# Altium schematic sheet MCU.SchDoc
size A3; SheetNumber: 7; SheetTotal: 10
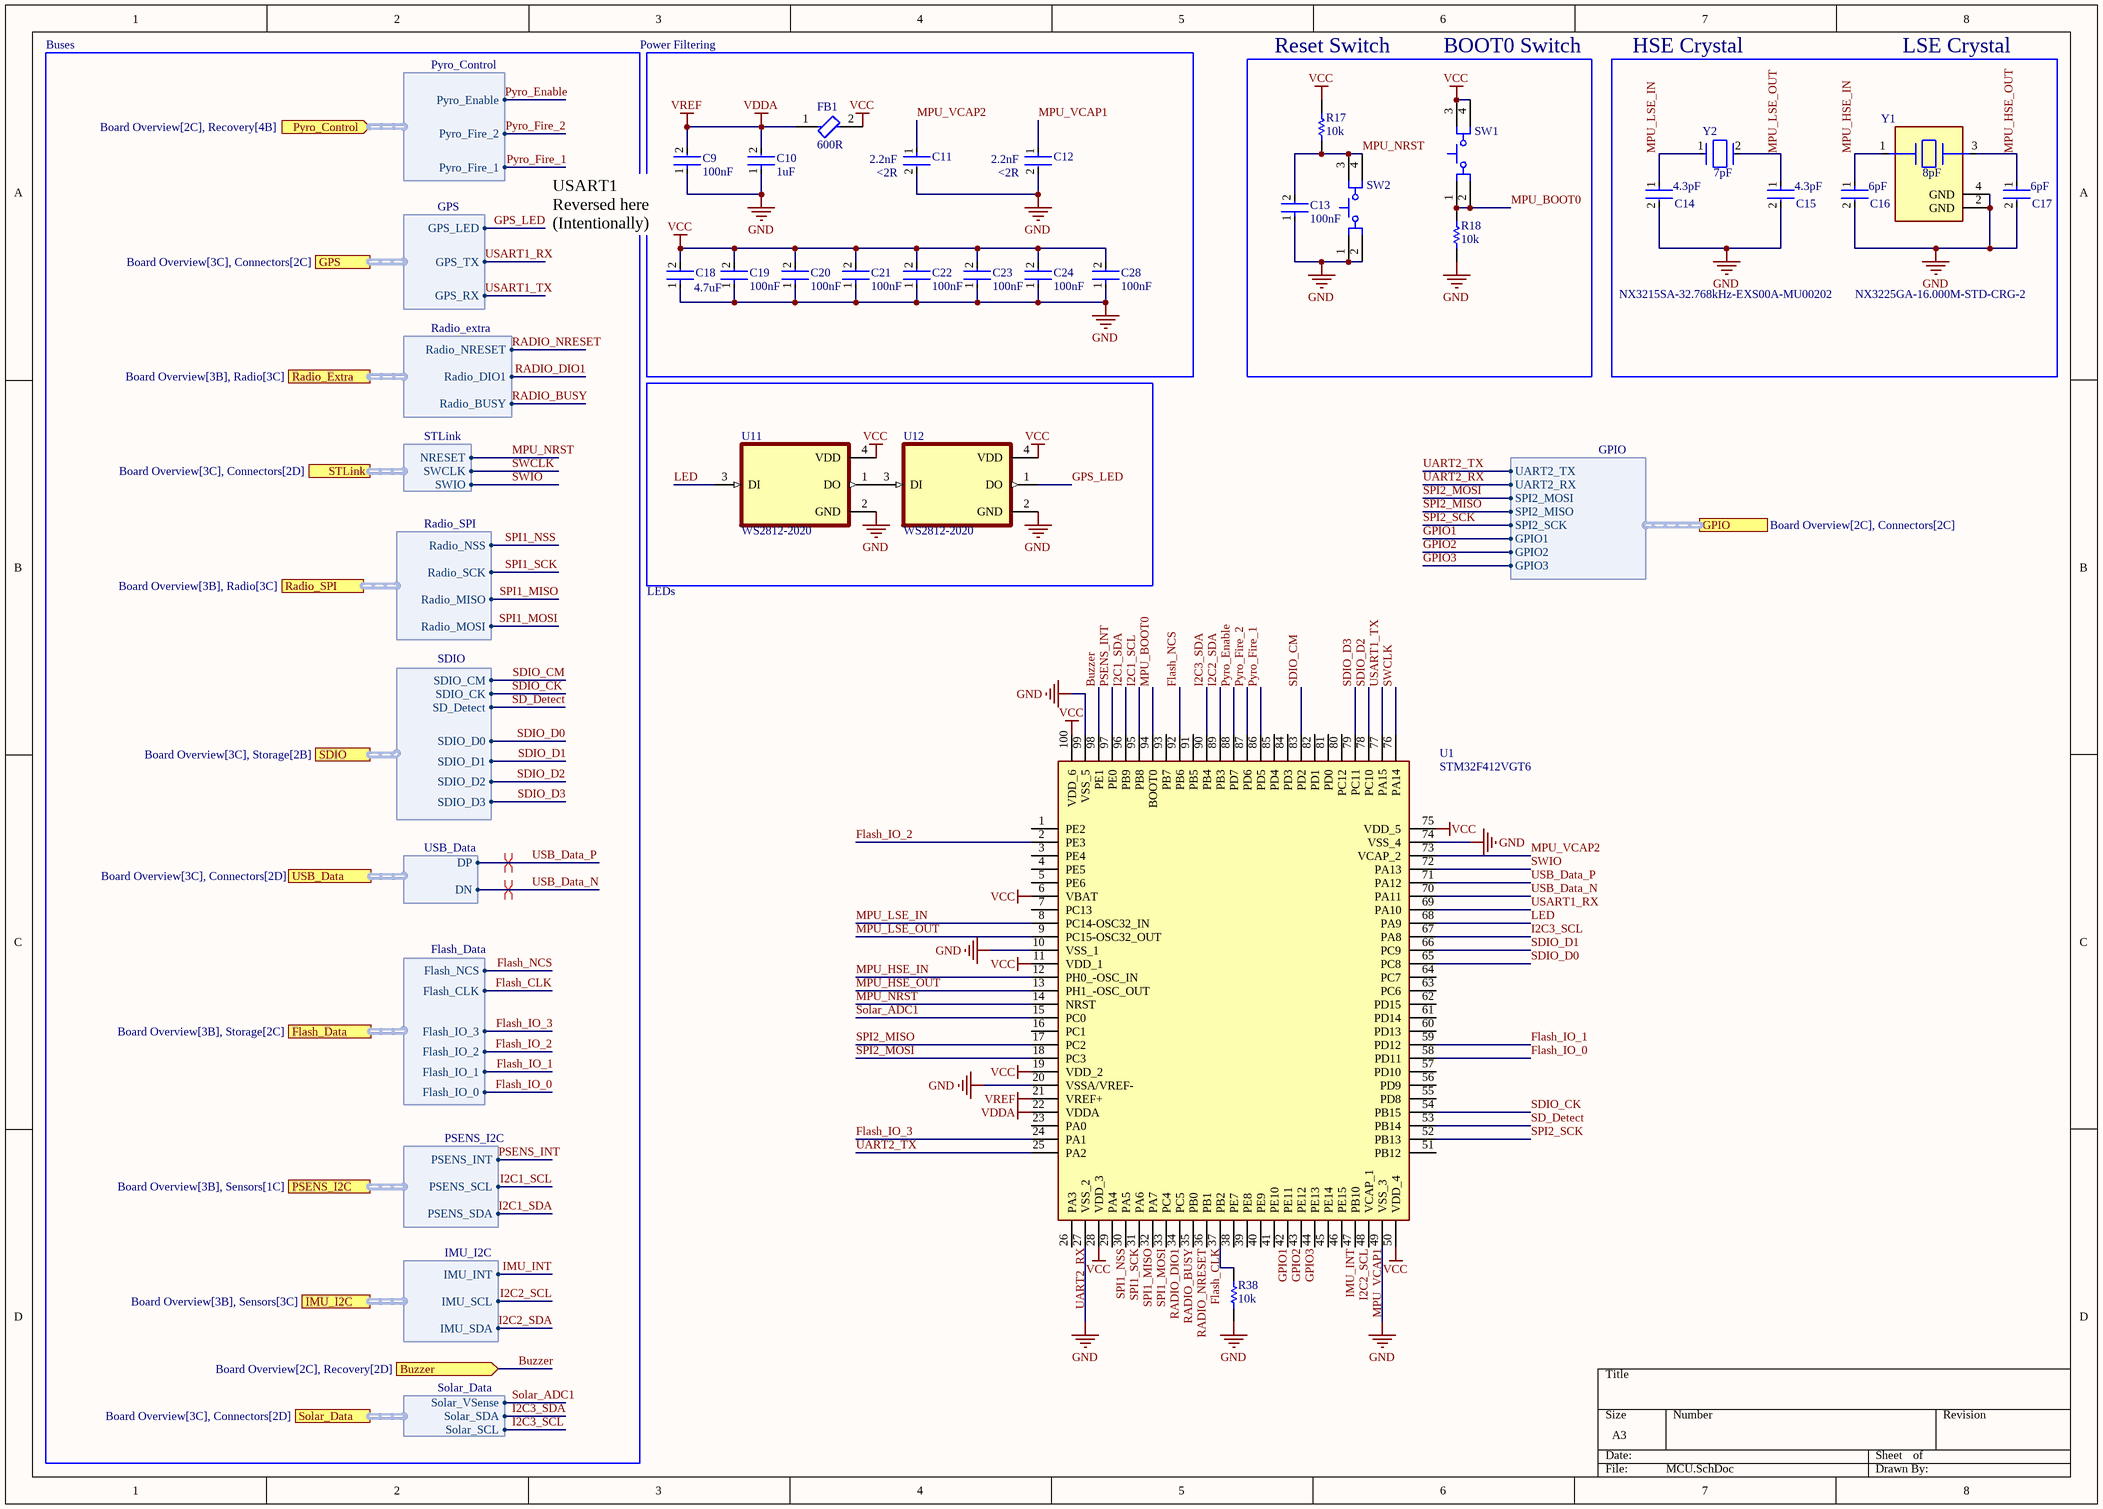
[diagram p0: MCU.SchDoc]

## Parts
C9  value 100nF  [FP-0603-L_1_6_0_15-W_0_81-IPC_C]  (hidden comment: Generic-Capacitor)
C10  value 1uF  [FP-0603-L_1_6_0_15-W_0_81-IPC_C]  (hidden comment: Generic-Capacitor)
C11  value 2.2nF  ESR: <2R  [FP-0603-L_1_6_0_15-W_0_81-IPC_C]  (hidden comment: Generic-Capacitor)
C12  value 2.2nF  ESR: <2R  [FP-0603-L_1_6_0_15-W_0_81-IPC_C]  (hidden comment: Generic-Capacitor)
C13  value 100nF  [FP-0603-L_1_6_0_15-W_0_81-IPC_C]  (hidden comment: Generic-Capacitor)
C14  value 4.3pF  [FP-CL10-IPC_B]  (hidden comment: 0603CG4R3C500NT)
C15  value 4.3pF  [FP-CL10-IPC_B]  (hidden comment: 0603CG4R3C500NT)
C16  value 6pF  [FP-CL10-IPC_B]  (hidden comment: CL10C060DB8NNNC)
C17  value 6pF  [FP-CL10-IPC_B]  (hidden comment: CL10C060DB8NNNC)
C18  value 4.7uF  [FP-0603-L_1_6_0_15-W_0_81-IPC_C]  (hidden comment: Generic-Capacitor)
C19  value 100nF  [FP-0603-L_1_6_0_15-W_0_81-IPC_C]  (hidden comment: Generic-Capacitor)
C20  value 100nF  [FP-0603-L_1_6_0_15-W_0_81-IPC_C]  (hidden comment: Generic-Capacitor)
C21  value 100nF  [FP-0603-L_1_6_0_15-W_0_81-IPC_C]  (hidden comment: Generic-Capacitor)
C22  value 100nF  [FP-0603-L_1_6_0_15-W_0_81-IPC_C]  (hidden comment: Generic-Capacitor)
C23  value 100nF  [FP-0603-L_1_6_0_15-W_0_81-IPC_C]  (hidden comment: Generic-Capacitor)
C24  value 100nF  [FP-0603-L_1_6_0_15-W_0_81-IPC_C]  (hidden comment: Generic-Capacitor)
C28  value 100nF  [FP-0603-L_1_6_0_15-W_0_81-IPC_C]  (hidden comment: Generic-Capacitor)
FB1  value 600R  [FP-BLM18-0_15-0_1-t0_6-IPC_B]  (hidden comment: GZ1608D601TF)
R17  value 10k  [RESC1608X55X25ML10T15]  (hidden comment: 0603WAF1002T5E)
R18  value 10k  [RESC1608X55X25ML10T15]  (hidden comment: 0603WAF1002T5E)
R38  value 10k  [RESC1609X50X30ML8T20]  (hidden comment: Generic-Resistor)
SW1  PTS645SM43SMTR92LFS  [CKCP-PTS645S_V]  (value not drawn)
SW2  PTS645SM43SMTR92LFS  [CKCP-PTS645S_V]  (value not drawn)
U1  STM32F412VGT6  [QFP50P1600X1600X160-100N]
U11  WS2812-2020  [LED_WS2812-2020]
U12  WS2812-2020  [LED_WS2812-2020]
Y1  NX3225GA-16.000M-STD-CRG-2  value 8pF  [FP-NX3225GA-MFG]
Y2  NX3215SA-32.768kHz-EXS00A-MU00202  value 7pF  [FP-NX3215SA-MFG]

## Ports
Buzzer (in, see Board Overview[2C], Recovery[2D]), Flash_Data (harness Flash_Data, see Board Overview[3B], Storage[2C]), GPIO (harness GPIO, see Board Overview[2C], Connectors[2C]), GPS (harness GPS, see Board Overview[3C], Connectors[2C]), IMU_I2C (harness IMU_I2C, see Board Overview[3B], Sensors[3C]), PSENS_I2C (harness PSENS_I2C, see Board Overview[3B], Sensors[1C]), Pyro_Control (in, harness Pyro_Control, see Board Overview[2C], Recovery[4B]), Radio_Extra (harness Radio_extra, see Board Overview[3B], Radio[3C]), Radio_SPI (harness Radio_SPI, see Board Overview[3B], Radio[3C]), SDIO (harness SDIO, see Board Overview[3C], Storage[2B]), Solar_Data (harness Solar_Data, see Board Overview[3C], Connectors[2D]), STLink (harness STLink, see Board Overview[3C], Connectors[2D]), USB_Data (harness USB_Data, see Board Overview[3C], Connectors[2D])

## Harnesses
USB_Data: DN, DP
Flash_Data: Flash_CLK, Flash_IO_0, Flash_IO_1, Flash_IO_2, Flash_IO_3, Flash_NCS
PSENS_I2C: PSENS_INT, PSENS_SCL, PSENS_SDA
IMU_I2C: IMU_INT, IMU_SCL, IMU_SDA
Radio_SPI: Radio_MOSI, Radio_MISO, Radio_SCK, Radio_NSS
Radio_extra: Radio_BUSY, Radio_DIO1, Radio_NRESET
Pyro_Control: Pyro_Fire_1, Pyro_Enable, Pyro_Fire_2
GPS: GPS_RX, GPS_TX, GPS_LED
SDIO: SDIO_CK, SDIO_CM, SDIO_D0, SDIO_D1, SDIO_D2, SDIO_D3, SD_Detect
Solar_Data: Solar_SCL, Solar_SDA, Solar_VSense
STLink: SWIO, SWCLK, NRESET
GPIO: UART2_TX, UART2_RX, SPI2_MOSI, SPI2_MISO, SPI2_SCK, GPIO1, GPIO2, GPIO3

## Nets
GND: C9.1 C10.1 C11.2 C12.2 C13.1 C14.2 C15.2 C16.2 C17.2 C18.1 C19.1 C20.1 C21.1 C22.1 C23.1 C24.1 C28.1 R18.1 R38.1 SW2.1 SW2.2 U1.10(VSS_1) U1.20(VSSA/VREF-) U1.27(VSS_2) U1.49(VSS_3) U1.74(VSS_4) U1.99(VSS_5) U11.2(GND) U12.2(GND) Y1.2(GND) Y1.4(GND)
VCC: C18.2 C19.2 C20.2 C21.2 C22.2 C23.2 C24.2 C28.2 FB1.2 R17.2 SW1.3 SW1.4 U1.6(VBAT) U1.11(VDD_1) U1.19(VDD_2) U1.28(VDD_3) U1.50(VDD_4) U1.75(VDD_5) U1.100(VDD_6) U11.4(VDD) U12.4(VDD)
VDDA: C9.2 C10.2 FB1.1 U1.21(VREF+) U1.22(VDDA)  [also labelled VREF]
Buzzer: U1.98(PE1) ; port Buzzer
Flash_CLK: U1.36(PB1) ; port Flash_Data.Flash_CLK
Flash_IO_0: U1.58(PD11) ; port Flash_Data.Flash_IO_0
Flash_IO_1: U1.59(PD12) ; port Flash_Data.Flash_IO_1
Flash_IO_2: U1.2(PE3) ; port Flash_Data.Flash_IO_2
Flash_IO_3: U1.24(PA1) ; port Flash_Data.Flash_IO_3
Flash_NCS: U1.92(PB6) ; port Flash_Data.Flash_NCS
GPIO1: U1.41(PE10) ; port GPIO.GPIO1
GPIO2: U1.42(PE11) ; port GPIO.GPIO2
GPIO3: U1.43(PE12) ; port GPIO.GPIO3
GPS_LED: U12.1(DO) ; port GPS.GPS_LED
I2C1_SCL: U1.95(PB8) ; port PSENS_I2C.PSENS_SCL
I2C1_SDA: U1.96(PB9) ; port PSENS_I2C.PSENS_SDA
I2C2_SCL: U1.47(PB10) ; port IMU_I2C.IMU_SCL
I2C2_SDA: U1.89(PB3) ; port IMU_I2C.IMU_SDA
I2C3_SCL: U1.67(PA8) ; port Solar_Data.Solar_SCL
I2C3_SDA: U1.90(PB4) ; port Solar_Data.Solar_SDA
IMU_INT: U1.46(PE15) ; port IMU_I2C.IMU_INT
LED: U1.68(PA9) U11.3(DI)
MPU_BOOT0: R18.2 SW1.1 SW1.2 U1.94(BOOT0)
MPU_HSE_IN: C16.1 U1.12(PH0_-OSC_IN) Y1.1
MPU_HSE_OUT: C17.1 U1.13(PH1_-OSC_OUT) Y1.3
MPU_LSE_IN: C14.1 U1.8(PC14-OSC32_IN) Y2.1
MPU_LSE_OUT: C15.1 U1.9(PC15-OSC32_OUT) Y2.2
MPU_NRST: C13.2 R17.1 SW2.3 SW2.4 U1.14(NRST) ; port STLink.NRESET
MPU_VCAP1: C12.1 U1.48(VCAP_1)
MPU_VCAP2: C11.1 U1.73(VCAP_2)
PSENS_INT: U1.97(PE0) ; port PSENS_I2C.PSENS_INT
Pyro_Enable: U1.88(PD7) ; port Pyro_Control.Pyro_Enable
Pyro_Fire_1: U1.86(PD5) ; port Pyro_Control.Pyro_Fire_1
Pyro_Fire_2: U1.87(PD6) ; port Pyro_Control.Pyro_Fire_2
RADIO_BUSY: U1.34(PC5) ; port Radio_Extra.Radio_BUSY
RADIO_DIO1: U1.33(PC4) ; port Radio_Extra.Radio_DIO1
RADIO_NRESET: U1.35(PB0) ; port Radio_Extra.Radio_NRESET
SD_Detect: U1.53(PB14) ; port SDIO.SD_Detect
SDIO_CK: U1.54(PB15) ; port SDIO.SDIO_CK
SDIO_CM: U1.83(PD2) ; port SDIO.SDIO_CM
SDIO_D0: U1.65(PC8) ; port SDIO.SDIO_D0
SDIO_D1: U1.66(PC9) ; port SDIO.SDIO_D1
SDIO_D2: U1.78(PC10) ; port SDIO.SDIO_D2
SDIO_D3: U1.79(PC11) ; port SDIO.SDIO_D3
Solar_ADC1: U1.15(PC0) ; port Solar_Data.Solar_VSense
SPI1_MISO: U1.31(PA6) ; port Radio_SPI.Radio_MISO
SPI1_MOSI: U1.32(PA7) ; port Radio_SPI.Radio_MOSI
SPI1_NSS: U1.29(PA4) ; port Radio_SPI.Radio_NSS
SPI1_SCK: U1.30(PA5) ; port Radio_SPI.Radio_SCK
SPI2_MISO: U1.17(PC2) ; port GPIO.SPI2_MISO
SPI2_MOSI: U1.18(PC3) ; port GPIO.SPI2_MOSI
SPI2_SCK: U1.52(PB13) ; port GPIO.SPI2_SCK
SWCLK: U1.76(PA14) ; port STLink.SWCLK
SWIO: U1.72(PA13) ; port STLink.SWIO
UART2_RX: U1.26(PA3) ; port GPIO.UART2_RX
UART2_TX: U1.25(PA2) ; port GPIO.UART2_TX
USART1_RX: U1.69(PA10) ; port GPS.GPS_TX
USART1_TX: U1.77(PA15) ; port GPS.GPS_RX
USB_Data_N: U1.70(PA11) ; port USB_Data.DN
USB_Data_P: U1.71(PA12) ; port USB_Data.DP
NetR38_2: R38.2 U1.37(PB2)
NetU11_1: U11.1(DO) U12.3(DI)

Not connected (* = marked no-connect by the designer): U1 1(PE2) 3(PE4) 4(PE5) 5(PE6) 7(PC13) 16(PC1) 23(PA0) 38(PE7) 39(PE8) 40(PE9) 44(PE13) 45(PE14) 51(PB12) 55(PD8) 56(PD9) 57(PD10) 60(PD13) 61(PD14) 62(PD15) 63(PC6) 64(PC7) 80(PC12) 81(PD0) 82(PD1) 84(PD3) 85(PD4) 91(PB5) 93(PB7)

## Layout directives
differential pair: USB_Data_N, USB_Data_P

## Notes on the sheet
- Buses
- Power Filtering
- Reset Switch
- BOOT0 Switch
- HSE Crystal
- LSE Crystal
- USART1 Reversed here (Intentionally)
- LEDs

## Library data of the parts
C9 = CMP-001-00088-6: Generic 0603 Capacitor; Tolerance: 10%; Dielectric: X7R; ESR: 0R; Voltage Rating: 50V; Case Code (Imperial): 0603; LCSC Part #: C14663
C10 C13 C18-C24 C28 = CMP-001-00088-6: Generic 0603 Capacitor; Dielectric: X7R; Voltage Rating: 50V; Tolerance: 10%; ESR: 0R; Case Code (Imperial): 0603
  C10: LCSC Part #: C15849
  C13 C19-C24 C28: LCSC Part #: C14663
  C18: LCSC Part #: C53987
C11 C12 = CMP-001-00088-6: Generic 0603 Capacitor; Dielectric: X7R; Voltage Rating: 50V; Tolerance: 10%; LCSC Part #: C1604; Case Code (Imperial): 0603
C14 C15 = CMP-001-00086-2: 50V 4.3pF C0G ±0.25pF 0603 Multilayer Ceramic Capacitors MLCC - SMD/SMT ROHS; LCSC PART #: C59526
C16 C17 = CMP-001-00087-1: CAP CER 6PF 50V C0G/NP0 0603; LCSC PART #: C37474
FB1 = CMP-006-00021-1: 0603 600Ω ±25% DCR=0.45Ω 0.2A; LCSC PART #: C1002
R17 R18 = CMP-009-00177-3: ±1% 1/10W Thick Film Resistors 75V ±100ppm/℃ -55℃~+155℃ 10kΩ 0603 Chip Resistor - Surface Mount ROHS; LCSC Part #: C25804
R38 = CMP-009-00185-4: Generic 0603 Resistor; Power Rating: 100mW; Tolerance: 0%; Voltage Rating: 75V; Case Code (Metric): 1608; Case Code (Imperial): 0603; LCSC Part #: C25804
SW1 SW2 = CMP-011-00016-1: Switch Tactile N.O. SPST Round Button Gull Wing 0.05A 12VDC 100000Cycles 1.57N SMD T/R; LCSC PART #: C221880
U1 = CMP-028-000000-1: STMICROELECTRONICS - STM32F412VGT6 - ARM MCU, STM32 Family STM32F4 Series Microcontrollers, ARM Cortex-M4F, 32bit, 100 MHz, 1 MB, 256 KB; Geometry.Height: 1.6mm; Manufacturer_Part_Number: STM32F412VGT6; Manufacturer_Name: STMicroelectronics; Mouser Price/Stock: https://www.mouser.co.uk/ProductDetail/STMicroelectronics/STM32F412VGT6/?qs=qzCNEk%252BRr%252BaGf9Ry5zWpvw%3D%3D; Design Item ID: STM32F412VGT6; Mouser Part Number: 511-STM32F412VGT6; Datasheet Link: https://4donline.ihs.com/images/VipMasterIC/IC/SGST/SGST-S-A0004202317/SGST-S-A0004202317-1.pdf?hkey=6D3A4C79FDBF58556ACFDE234799DDF0; Source: STM32F412VGT6.SchLib; Package: 100-LQFP; LCSC Part #: C727951
U11 U12 = CMP-002-000000-1: Intelligent control LED light source, SMD-4; MF: Worldsemi; Value: *; Pin Count: 4; Check_prices: https://www.snapeda.com/parts/WS2812-2020/Worldsemi/view-part/?ref=eda; Package: Package; SnapEDA_Link: https://www.snapeda.com/parts/WS2812-2020/Worldsemi/view-part/?ref=snap; Price: None; MP: WS2812-2020; Availability: Not in stock; Design Item ID: WS2812-2020; Source: WS2812-2020.SchLib; Component Type: Standard; LCSC Part #: C965555
Y1 = CMP-003-00030-1: Crystal 16MHz ±20ppm (Tol) ±30ppm (Stability) 8pF FUND 80Ohm Automotive 4-Pin SMD; LCSC PART #: C156247
Y2 = CMP-003-00031-1: Crystal 32.7680KHZ 7PF SMD; LCSC PART #: C280830